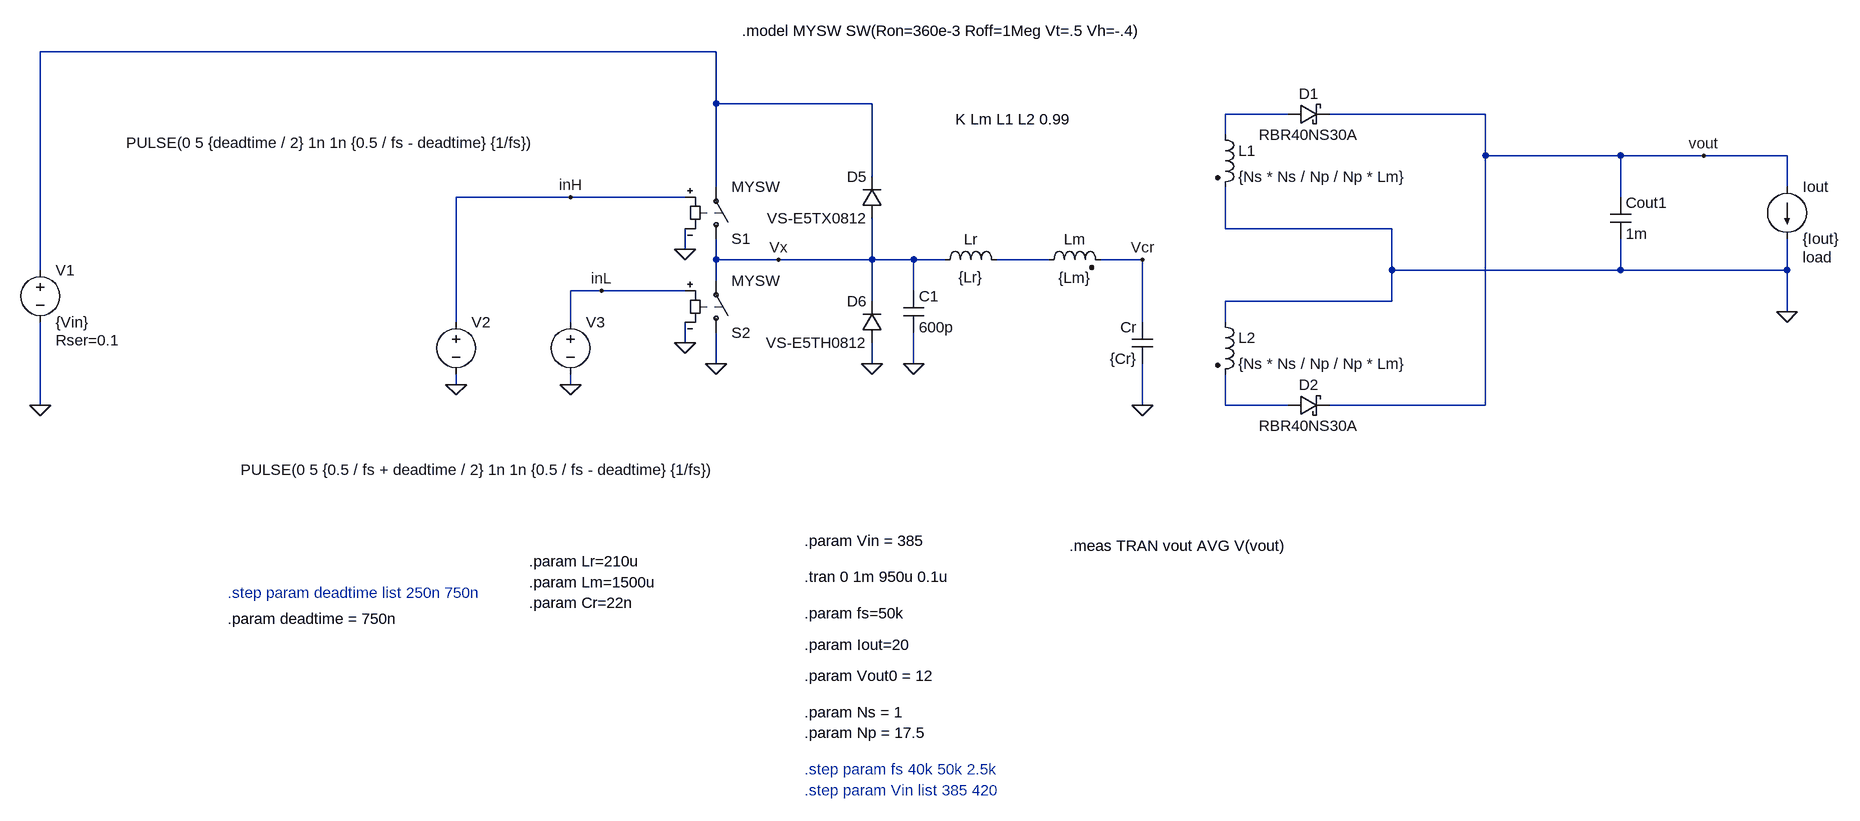
[diagram p0: schematic LLC_LTSpice0.asc]
LLC_LTSpice0.asc, the LTspice schematic file:
Version 4
SHEET 1 2344 1108
WIRE -80 -224 -1120 -224
WIRE -80 -144 -80 -224
WIRE 160 -144 -80 -144
WIRE 800 -128 704 -128
WIRE 1104 -128 864 -128
WIRE 704 -96 704 -128
WIRE 1104 -64 1104 -128
WIRE 1312 -64 1104 -64
WIRE 1440 -64 1312 -64
WIRE 1568 -64 1440 -64
WIRE 160 -32 160 -144
WIRE -80 -16 -80 -144
WIRE 1568 -16 1568 -64
WIRE -304 0 -480 0
WIRE -128 0 -304 0
WIRE 1312 0 1312 -64
WIRE 704 48 704 -16
WIRE 960 48 704 48
WIRE -128 80 -128 48
WIRE -80 96 -80 64
WIRE 16 96 -80 96
WIRE 160 96 160 32
WIRE 160 96 16 96
WIRE 224 96 160 96
WIRE 272 96 224 96
WIRE 432 96 352 96
WIRE 576 96 512 96
WIRE -1120 112 -1120 -224
WIRE 960 112 960 48
WIRE 1312 112 1312 64
WIRE 1312 112 960 112
WIRE 1568 112 1568 64
WIRE 1568 112 1312 112
WIRE -80 128 -80 96
WIRE -256 144 -304 144
WIRE -128 144 -256 144
WIRE 224 144 224 96
WIRE 160 160 160 96
WIRE 960 160 960 112
WIRE 960 160 704 160
WIRE 1568 176 1568 112
WIRE -480 192 -480 0
WIRE -304 192 -304 144
WIRE 576 192 576 96
WIRE 704 192 704 160
WIRE -128 224 -128 192
WIRE -80 256 -80 208
WIRE 160 256 160 224
WIRE 224 256 224 208
WIRE -480 288 -480 272
WIRE -304 288 -304 272
WIRE -1120 320 -1120 192
WIRE 576 320 576 256
WIRE 704 320 704 272
WIRE 800 320 704 320
WIRE 1104 320 1104 -64
WIRE 1104 320 864 320
FLAG 1440 -64 vout
FLAG 1568 176 0
FLAG 576 320 0
FLAG 576 96 Vcr
FLAG -1120 320 0
FLAG -80 256 0
FLAG -128 224 0
FLAG -128 80 0
FLAG -480 288 0
FLAG -304 288 0
FLAG 224 256 0
FLAG 160 256 0
FLAG -304 0 inH
FLAG -256 144 inL
FLAG 16 96 Vx
SYMBOL ind 256 112 R270
WINDOW 0 32 56 VTop 2
WINDOW 3 5 56 VBottom 2
SYMATTR InstName Lr
SYMATTR Value {Lr}
SYMBOL ind2 416 112 R270
WINDOW 0 32 56 VTop 2
WINDOW 3 4 56 VBottom 2
SYMATTR InstName Lm
SYMATTR Value {Lm}
SYMATTR Type ind
SYMBOL cap 592 256 R180
WINDOW 0 24 56 Left 2
WINDOW 3 24 8 Left 2
SYMATTR InstName Cr
SYMATTR Value {Cr}
SYMBOL ind2 688 -112 R0
SYMATTR InstName L1
SYMATTR Value {Ns * Ns / Np / Np * Lm}
SYMATTR Type ind
SYMBOL ind2 688 176 R0
SYMATTR InstName L2
SYMATTR Value {Ns * Ns / Np / Np * Lm}
SYMATTR Type ind
SYMBOL voltage -1120 96 R0
WINDOW 123 0 0 Left 0
WINDOW 39 24 124 Left 2
SYMATTR SpiceLine Rser=0.1
SYMATTR InstName V1
SYMATTR Value {Vin}
SYMBOL voltage -480 176 R0
WINDOW 123 0 0 Left 0
WINDOW 39 24 124 Left 2
WINDOW 3 -508 -260 Left 2
SYMATTR Value PULSE(0 5 {deadtime / 2} 1n 1n {0.5 / fs - deadtime} {1/fs})
SYMATTR InstName V2
SYMBOL voltage -304 176 R0
WINDOW 123 0 0 Left 0
WINDOW 39 24 124 Left 2
WINDOW 3 -508 243 Left 2
SYMATTR Value PULSE(0 5 {0.5 / fs + deadtime / 2} 1n 1n {0.5 / fs - deadtime} {1/fs})
SYMATTR InstName V3
SYMBOL current 1568 -16 R0
WINDOW 123 0 0 Left 0
WINDOW 39 24 108 Left 2
SYMATTR SpiceLine load
SYMATTR InstName Iout
SYMATTR Value {Iout}
SYMBOL schottky 800 -112 R270
WINDOW 0 32 32 VTop 2
WINDOW 3 0 32 VBottom 2
SYMATTR InstName D1
SYMATTR Value RBR40NS30A
SYMATTR Description Diode
SYMATTR Type diode
SYMBOL schottky 800 336 R270
WINDOW 0 32 32 VTop 2
WINDOW 3 0 32 VBottom 2
SYMATTR InstName D2
SYMATTR Value RBR40NS30A
SYMATTR Description Diode
SYMATTR Type diode
SYMBOL cap 1296 0 R0
SYMATTR InstName Cout1
SYMATTR Value 1m
SYMATTR SpiceLine IC={Vout0}
SYMBOL sw -80 80 M180
SYMATTR InstName S1
SYMATTR Value MYSW
SYMBOL sw -80 224 M180
SYMATTR InstName S2
SYMATTR Value MYSW
SYMBOL cap 208 144 R0
SYMATTR InstName C1
SYMATTR Value 600p
SYMBOL diode 176 32 R180
WINDOW 0 24 64 Left 2
WINDOW 3 24 0 Left 2
SYMATTR InstName D5
SYMATTR Value VS-E5TX0812
SYMBOL diode 176 224 R180
WINDOW 0 24 64 Left 2
WINDOW 3 24 0 Left 2
SYMATTR InstName D6
SYMATTR Value VS-E5TH0812
TEXT 288 -120 Left 2 !K Lm L1 L2 0.99
TEXT 56 792 Left 2 !.param Ns = 1
TEXT -368 560 Left 2 !.param Lr=210u
TEXT -368 592 Left 2 !.param Lm=1500u
TEXT -368 624 Left 2 !.param Cr=22n
TEXT 56 528 Left 2 !.param Vin = 385
TEXT -832 608 Left 2 ;.step param deadtime list 250n 750n
TEXT 56 688 Left 2 !.param Iout=20
TEXT 56 736 Left 2 !.param Vout0 = 12
TEXT 56 640 Left 2 !.param fs=50k
TEXT 56 824 Left 2 !.param Np = 17.5
TEXT 56 584 Left 2 !.tran 0 1m 950u 0.1u
TEXT 56 880 Left 2 ;.step param fs 40k 50k 2.5k
TEXT 464 536 Left 2 !.meas TRAN vout AVG V(vout)
TEXT 56 912 Left 2 ;.step param Vin list 385 420
TEXT -40 -256 Left 2 !.model MYSW SW(Ron=360e-3 Roff=1Meg Vt=.5 Vh=-.4)
TEXT -832 648 Left 2 !.param deadtime = 750n

The netlist it stands for:
* LLC_LTSpice0.asc
Lr Vx N003 {Lr}
Lm N003 Vcr {Lm}
Cr 0 Vcr {Cr}
L1 N002 0 {Ns * Ns / Np / Np * Lm}
L2 0 N004 {Ns * Ns / Np / Np * Lm}
V1 N001 0 {Vin} Rser=0.1
V2 inH 0 PULSE(0 5 {deadtime / 2} 1n 1n {0.5 / fs - deadtime} {1/fs})
V3 inL 0 PULSE(0 5 {0.5 / fs + deadtime / 2} 1n 1n {0.5 / fs - deadtime} {1/fs})
Iout vout 0 {Iout} load
D1 N002 vout RBR40NS30A
D2 N004 vout RBR40NS30A
Cout1 vout 0 1m IC={Vout0}
S1 Vx N001 inH 0 MYSW
S2 0 Vx inL 0 MYSW
C1 Vx 0 600p
D5 Vx N001 VS-E5TX0812
D6 0 Vx VS-E5TH0812
.model D D
.lib standard.dio
K Lm L1 L2 0.99
.param Ns = 1
.param Lr=210u
.param Lm=1500u
.param Cr=22n
.param Vin = 385
* .step param deadtime list 250n 750n
.param Iout=20
.param Vout0 = 12
.param fs=50k
.param Np = 17.5
.tran 0 1m 950u 0.1u
* .step param fs 40k 50k 2.5k
.meas TRAN vout AVG V(vout)
* .step param Vin list 385 420
.model MYSW SW(Ron=360e-3 Roff=1Meg Vt=.5 Vh=-.4)
.param deadtime = 750n
.backanno
.end